# EAGLE design hydrogen_sensors_board_v3 (EAGLE 9.1.0)
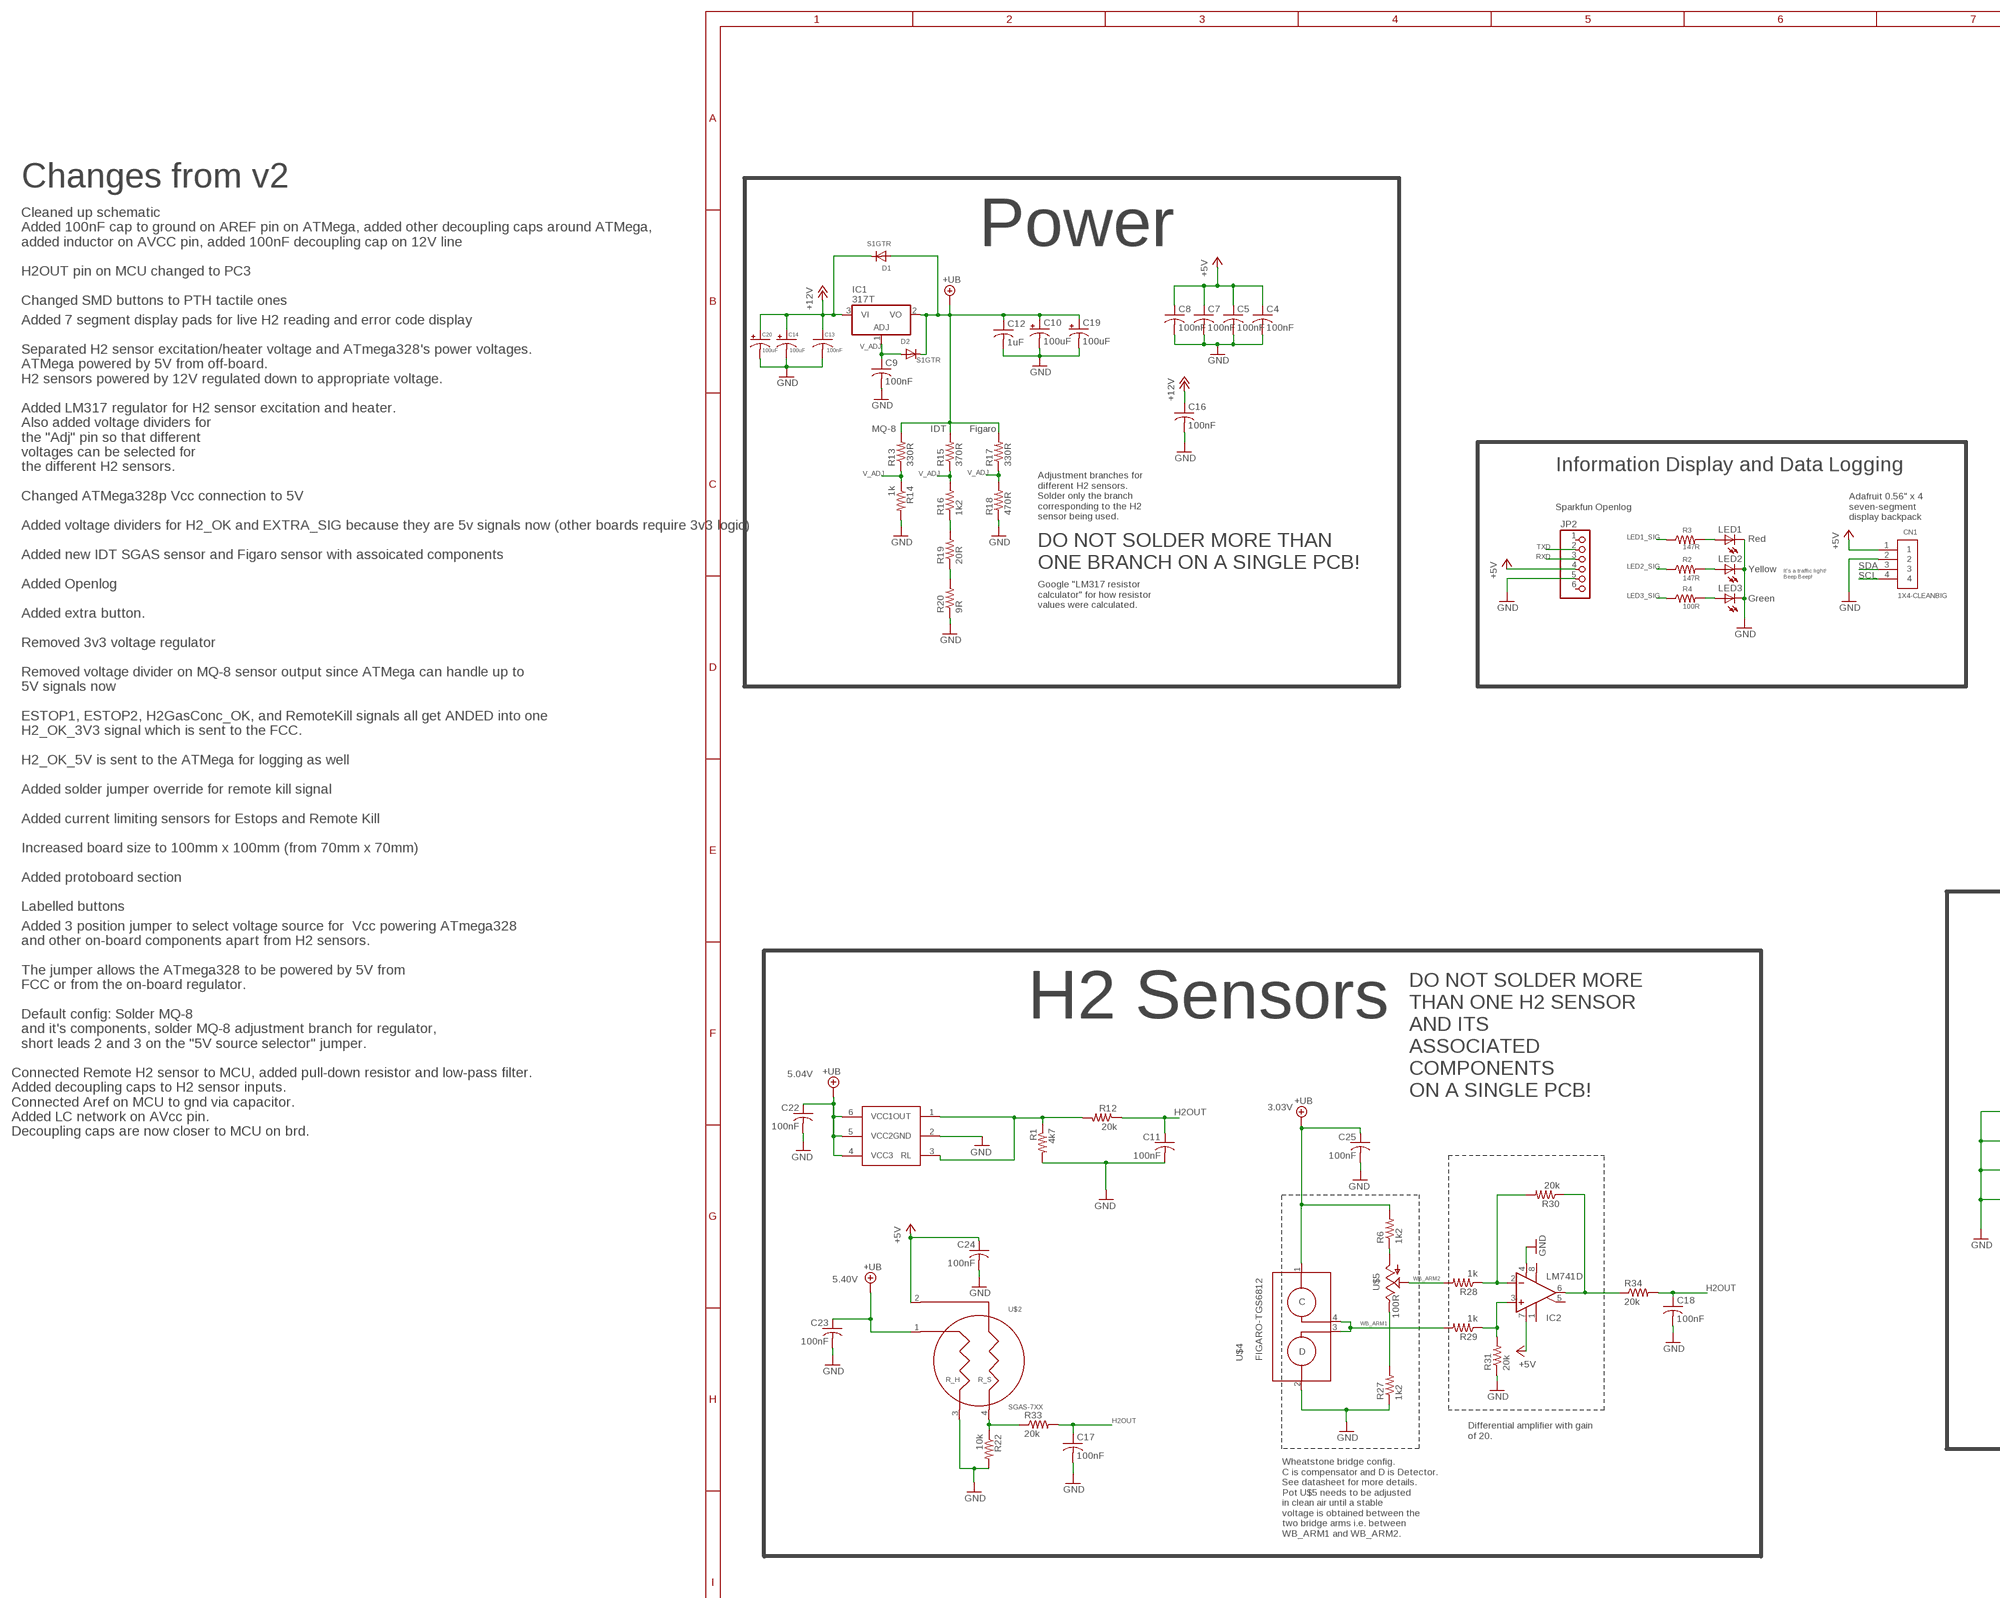
[diagram p0: schematic, sheet 1, part 1 of 2]
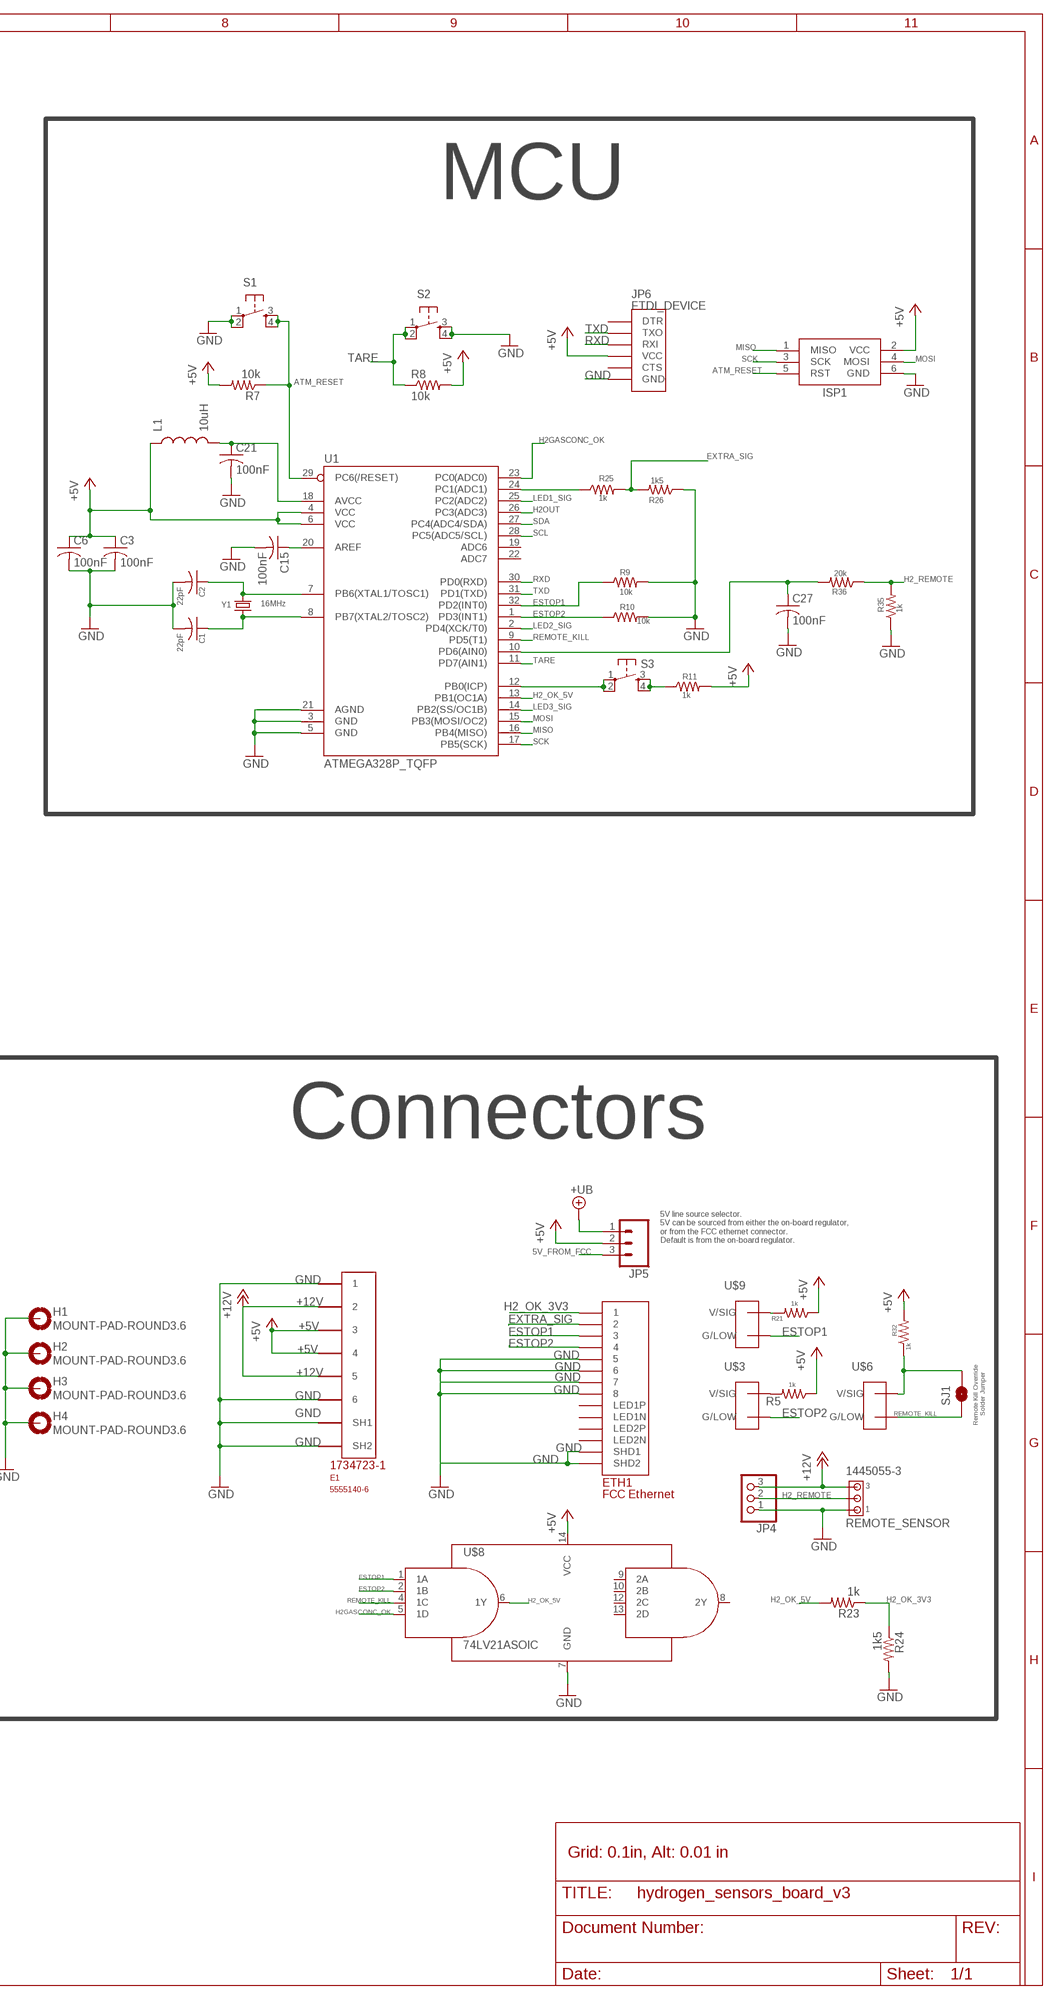
[diagram p1: schematic, sheet 1, part 2 of 2]

## Parts
C1  22pF  C-USC0603K  [C0603K]
C2  22pF  C-USC0603K  [C0603K]
C3  100nF  C-USC0603  [C0603]
C4  100nF  C-USC0603  [C0603]
C5  100nF  C-USC0603  [C0603]
C6  100nF  C-USC0603  [C0603]
C7  100nF  C-USC0603  [C0603]
C8  100nF  C-USC0603  [C0603]
C9  100nF  C-USC0603  [C0603]
C10  100uF  CPOL-USB/3528-21R  [B/3528-21R]
C11  100nF  C-USC0603  [C0603]
C12  1uF  C-USC0603  [C0603]
C13  100nF  C-USC0603  [C0603]
C14  100uF  CPOL-USB/3528-21R  [B/3528-21R]
C15  100nF  C-USC0603  [C0603]
C16  100nF  C-USC0603  [C0603]
C17  100nF  C-USC0603  [C0603]
C18  100nF  C-USC0603  [C0603]
C19  100uF  CAP_POLPTH1  [CPOL-RADIAL-100UF-25V]
C20  100uF  CAP_POLPTH1  [CPOL-RADIAL-100UF-25V]
C21  100nF  C-USC0603  [C0603]
C22  100nF  C-USC0603  [C0603]
C23  100nF  C-USC0603  [C0603]
C24  100nF  C-USC0603  [C0603]
C25  100nF  C-USC0603  [C0603]
C27  100nF  C-USC0603  [C0603]
CN1  1X4-CLEANBIG  [1X04-CLEANBIG]
D1  S1GTR  DIODESMA  [SMADIODE]
D2  S1GTR  DIODESMA  [SMADIODE]
E1  5555140-6  [1734723-1_RJ11]
ETH1  FCC Ethernet  ETHERNET  [A122645-ND]
H1  MOUNT-PAD-ROUND3.6  [3,6-PAD]
H2  MOUNT-PAD-ROUND3.6  [3,6-PAD]
H3  MOUNT-PAD-ROUND3.6  [3,6-PAD]
H4  MOUNT-PAD-ROUND3.6  [3,6-PAD]
IC1  317T  [TO220H]
IC2  LM741D  [SO08]
ISP1  AVRISP-BOX  [AVRISP-BOX]
JP2  PINHD-1X6LOCK  [1X06-BIGLOCK]
JP4  PINHD-1X3  [1X03]
JP5  M03PTH  [1X03]
JP6  FTDI_DEVICE  [FTDI_DEVICE_SIDE]
L1  10uH  INDUCTOR0603  [0603]
LED1  Red  LEDCHIPLED_0805  [CHIPLED_0805]
LED2  Yellow  LEDCHIPLED_0805  [CHIPLED_0805]
LED3  Green  LEDCHIPLED_0805  [CHIPLED_0805]
R1  4k7  RESISTOR0603-RES  [0603-RES]
R2  147R  RESISTOR0603-RES  [0603-RES]
R3  147R  RESISTOR0603-RES  [0603-RES]
R4  100R  RESISTOR0603-RES  [0603-RES]
R5  1k  RESISTOR0603-RES  [0603-RES]
R6  1k2  RESISTOR0603-RES  [0603-RES]
R7  10k  RESISTOR0603-RES  [0603-RES]
R8  10k  RESISTOR0603-RES  [0603-RES]
R9  10k  RESISTOR0603-RES  [0603-RES]
R10  10k  RESISTOR0603-RES  [0603-RES]
R11  1k  RESISTOR0603-RES  [0603-RES]
R12  20k  RESISTOR0603-RES  [0603-RES]
R13  330R  RESISTOR0603-RES  [0603-RES]
R14  1k  RESISTOR0603-RES  [0603-RES]
R15  370R  RESISTOR0603-RES  [0603-RES]
R16  1k2  RESISTOR0603-RES  [0603-RES]
R17  330R  RESISTOR0603-RES  [0603-RES]
R18  470R  RESISTOR0603-RES  [0603-RES]
R19  20R  RESISTOR0603-RES  [0603-RES]
R20  9R  RESISTOR0603-RES  [0603-RES]
R21  1k  RESISTOR0603-RES  [0603-RES]
R22  10k  RESISTOR0603-RES  [0603-RES]
R23  1k  RESISTOR0603-RES  [0603-RES]
R24  1k5  RESISTOR0603-RES  [0603-RES]
R25  1k  RESISTOR0603-RES  [0603-RES]
R26  1k5  RESISTOR0603-RES  [0603-RES]
R27  1k2  RESISTOR0603-RES  [0603-RES]
R28  1k  RESISTOR0603-RES  [0603-RES]
R29  1k  RESISTOR0603-RES  [0603-RES]
R30  20k  RESISTOR0603-RES  [0603-RES]
R31  20k  RESISTOR0603-RES  [0603-RES]
R32  1k  RESISTOR0603-RES  [0603-RES]
R33  20k  RESISTOR0603-RES  [0603-RES]
R34  20k  RESISTOR0603-RES  [0603-RES]
R35  1k  RESISTOR0603-RES  [0603-RES]
R36  20k  RESISTOR0603-RES  [0603-RES]
REMOTE_SENSOR  1445055-3  [1445055-3]
S1  TAC_SWITCHPTH  [TACTILE-PTH]
S2  TAC_SWITCHPTH  [TACTILE-PTH]
S3  TAC_SWITCHPTH  [TACTILE-PTH]
SJ1  SOLDERJUMPERNO  [SJ_2S-NO]
U1  ATMEGA328P_TQFP  [TQFP32-08]
U$1  MQ-8MQ-8  [MQ-8]
U$2  SGAS-7XX  [TO39]
U$3  TE770966  [2X1-MATE-N-LOCK]
U$4  FIGARO-TGS6812  [4PTH]
U$5  100R  POT100K_3362U  [3362U]
U$6  TE770966  [2X1-MATE-N-LOCK]
U$8  74LV21ASOIC  [SOIC-14]
U$9  TE770966  [2X1-MATE-N-LOCK]
Y1  16MHz  CRYSTALHC49US  [HC49US]

## Nets
5V_FROM_FCC: JP5.3
+5V: C3.1 C4.1 C5.1 C6.1 C7.1 C8.1 C24.1 CN1.1 E1.3 E1.4 IC2.7(V+) ISP1.2(VCC) JP2.4 JP5.2 JP6.P$4(VCC) L1.1 R5.1 R7.2 R8.2 R11.2 R21.1 R32.2 U1.4(VCC) U1.6(VCC) U$2.2 U$8.14(VCC)
+12V: C13.1 C14.+ C16.1 C20.1(+) D1.C E1.2 E1.5 IC1.3(VI) JP4.3 REMOTE_SENSOR.3
+UB: C10.+ C12.1 C19.1(+) C22.1 C23.1 C25.1 D1.A D2.C IC1.2(VO) JP5.1 R6.2 R13.2 R15.2 R17.2 U$1.4(VCC3) U$1.5(VCC2) U$1.6(VCC1) U$2.1 U$4.1
ATM_RESET: ISP1.5(RST) R7.1 S1.3 S1.4 U1.29(PC6(/RESET))
ESTOP1: ETH1.P$3 R9.1 U1.32(PD2(INT0)) U$8.1(1A) U$9.CIRCUIT2(G/LOW)
ESTOP2: ETH1.P$4 R10.1 U1.1(PD3(INT1)) U$3.CIRCUIT2(G/LOW) U$8.2(1B)
EXTRA_SIG: ETH1.P$2 R25.2 R26.2
GND: C1.2 C2.2 C3.2 C4.2 C5.2 C6.2 C7.2 C8.2 C9.2 C10.- C11.2 C12.2 C13.2 C14.- C15.2 C16.2 C17.2 C18.2 C19.2(-) C20.2(-) C21.2 C22.2 C23.2 C24.2 C25.2 C27.2 CN1.2 E1.1 E1.6 E1.SH1 E1.SH2 ETH1.P$5 ETH1.P$6 ETH1.P$7 ETH1.P$8 ETH1.P$13(SHD1) ETH1.P$14(SHD2) H1.B3,6(MOUNT) H2.B3,6(MOUNT) H3.B3,6(MOUNT) H4.B3,6(MOUNT) IC2.4(V-) ISP1.6(GND) JP2.5 JP4.1 JP6.P$6(GND) LED1.C LED2.C LED3.C R1.2 R9.2 R10.2 R14.2 R18.1 R20.1 R22.2 R24.2 R26.1 R27.1 R31.1 R35.1 REMOTE_SENSOR.1 S1.1 S1.2 S2.3 S2.4 U1.3(GND) U1.5(GND) U1.21(AGND) U$1.2(GND) U$2.3 U$4.2 U$8.7(GND)
H2_OK_3V3: ETH1.P$1 R23.1 R24.1
H2_OK_5V: R23.2 U1.13(PB1(OC1A)) U$8.6(1Y)
H2_REMOTE: JP4.2 R35.2 R36.1 REMOTE_SENSOR.2
H2GASCONC_OK: U1.23(PC0(ADC0)) U$8.5(1D)
H2OUT: C11.1 C17.1 C18.1 R12.1 R33.2 R34.2 U1.26(PC3(ADC3))
LED1_SIG: R3.1 U1.25(PC2(ADC2))
LED2_SIG: R2.1 U1.2(PD4(XCK/T0))
LED3_SIG: R4.1 U1.14(PB2(SS/OC1B))
MISO: ISP1.1(MISO) U1.16(PB4(MISO))
MOSI: ISP1.4(MOSI) U1.15(PB3(MOSI/OC2))
N$1: C2.1 U1.7(PB6(XTAL1/TOSC1)) Y1.2
N$2: R6.1 U$5.P$3(A)
N$3: C1.1 U1.8(PB7(XTAL2/TOSC2)) Y1.1
N$4: C15.1 U1.20(AREF)
N$5: R22.1 R33.1 U$2.4
N$6: C27.1 R36.2 U1.10(PD6(AIN0))
N$7: LED1.A R3.2
N$8: LED2.A R2.2
N$9: LED3.A R4.2
N$10: R27.2 U$5.P$1(E)
N$11: R21.2 U$9.CIRCUIT1(V/SIG)
N$12: R25.1 U1.24(PC1(ADC1))
N$13: IC2.2(-IN) R28.1 R30.2
N$14: R16.1 R19.2
N$15: S3.1 S3.2 U1.12(PB0(ICP))
N$16: R11.1 S3.3 S3.4
N$17: R19.1 R20.2
N$18: R1.1 R12.2 U$1.1(OUT) U$1.3(RL)
N$20: IC2.6(OUT) R30.1 R34.1
N$21: R5.2 U$3.CIRCUIT1(V/SIG)
N$22: IC2.3(+IN) R29.1 R31.2
N$24: R32.1 SJ1.2 U$6.CIRCUIT1(V/SIG)
N$62: C21.1 L1.2 U1.18(AVCC)
REMOTE_KILL: SJ1.1 U1.9(PD5(T1)) U$6.CIRCUIT2(G/LOW) U$8.4(1C)
RXD: JP2.3 JP6.P$3(RXI) U1.30(PD0(RXD))
SCK: ISP1.3(SCK) U1.17(PB5(SCK))
SCL: CN1.4 U1.28(PC5(ADC5/SCL))
SDA: CN1.3 U1.27(PC4(ADC4/SDA))
TARE: R8.1 S2.1 S2.2 U1.11(PD7(AIN1))
TXD: JP2.2 JP6.P$2(TXO) U1.31(PD1(TXD))
V_ADJ: C9.1 D2.A IC1.1(ADJ) R13.1 R14.1 R15.1 R16.2 R17.1 R18.2
WB_ARM1: R29.2 U$4.3 U$4.4
WB_ARM2: R28.2 U$5.P$2(S)
Unconnected: ETH1.P$9(LED1N) ETH1.P$10(LED1P) ETH1.P$11(LED2N) ETH1.P$12(LED2P) IC2.1(ON1) IC2.5(ON2) IC2.8(OPT) JP2.1 JP2.6 JP6.P$1(DTR) JP6.P$5(CTS) U1.19(ADC6) U1.22(ADC7) U$8.8(2Y) U$8.9(2A) U$8.10(2B) U$8.12(2C) U$8.13(2D)

## Notes on the sheet
- MCU
- Changes from v2
- Cleaned up schematic
  Added 100nF cap to ground on AREF pin on ATMega, added other decoupling caps around ATMega, 
  added inductor on AVCC pin, added 100nF decoupling cap on 12V line
- Power
- H2OUT pin on MCU changed to PC3
- Changed SMD buttons to PTH tactile ones
- Added 7 segment display pads for live H2 reading and error code display
- Separated H2 sensor excitation/heater voltage and ATmega328's power voltages.
  ATMega powered by 5V from off-board.
  H2 sensors powered by 12V regulated down to appropriate voltage.
- MQ-8 | IDT | Figaro
- Added LM317 regulator for H2 sensor excitation and heater.
  Also added voltage dividers for 
  the "Adj" pin so that different 
  voltages can be selected for
  the different H2 sensors.
- Information Display and Data Logging
- Changed ATMega328p Vcc connection to 5V
- Sparkfun Openlog
- Adafruit 0.56" x 4 
  seven-segment 
  display backpack
- Added voltage dividers for H2_OK and EXTRA_SIG because they are 5v signals now (other boards require 3v3 logic)
- Adjustment branches for 
  different H2 sensors. 
  Solder only the branch 
  corresponding to the H2 
  sensor being used.
- Added new IDT SGAS sensor and Figaro sensor with assoicated components
- DO NOT SOLDER MORE THAN
  ONE BRANCH ON A SINGLE PCB!
- It's a traffic light!
  Beep Beep!
- Added Openlog
- Google "LM317 resistor 
  calculator" for how resistor 
  values were calculated.
- Added extra button.
- Removed 3v3 voltage regulator
- Removed voltage divider on MQ-8 sensor output since ATMega can handle up to 
  5V signals now
  
  ESTOP1, ESTOP2, H2GasConc_OK, and RemoteKill signals all get ANDED into one
  H2_OK_3V3 signal which is sent to the FCC.
- H2_OK_5V is sent to the ATMega for logging as well
- Added solder jumper override for remote kill signal
  
  Added current limiting sensors for Estops and Remote Kill
- Increased board size to 100mm x 100mm (from 70mm x 70mm)
  
  Added protoboard section
  
  Labelled buttons
- Connectors
- H2 Sensors
- Added 3 position jumper to select voltage source for  Vcc powering ATmega328
  and other on-board components apart from H2 sensors.
  
  The jumper allows the ATmega328 to be powered by 5V from 
  FCC or from the on-board regulator.
  
  Default config: Solder MQ-8 
  and it's components, solder MQ-8 adjustment branch for regulator, 
  short leads 2 and 3 on the "5V source selector" jumper.
- 5V line source selector.
  5V can be sourced from either the on-board regulator, 
  or from the FCC ethernet connector.
  Default is from the on-board regulator.
- 5.04V
- DO NOT SOLDER MORE
  THAN ONE H2 SENSOR
  AND ITS 
  ASSOCIATED 
  COMPONENTS
  ON A SINGLE PCB!
- 3.03V
- Connected Remote H2 sensor to MCU, added pull-down resistor and low-pass filter.
  Added decoupling caps to H2 sensor inputs.
  Connected Aref on MCU to gnd via capacitor.
  Added LC network on AVcc pin.
  Decoupling caps are now closer to MCU on brd.
- Remote Kill Override 
  Solder Jumper
- 5.40V
- Differential amplifier with gain
  of 20.
- Wheatstone bridge config.
  C is compensator and D is Detector.
  See datasheet for more details.
  Pot U$5 needs to be adjusted
  in clean air until a stable
  voltage is obtained between the
  two bridge arms i.e. between
  WB_ARM1 and WB_ARM2.
- Grid: 0.1in, Alt: 0.01 in

## Library data of the parts
C1-C9 C11-C13 C15-C18 C21-C25 C27 = adafruit:C-US: CAPACITOR, American symbol
C10 C14 = adafruit:CPOL-US: POLARIZED CAPACITOR, American symbol
C19 C20 = SparkFun-Capacitors:CAP_POL: Capacitor Polarized These are standard SMD and PTH capacitors. Normally 10uF, 47uF, and 100uF in electrolytic and tantalum varieties. Always verify the external diameter of the through hole cap, it varies with capacity, voltage, and manufacturer. The EIA devices should be standard.
CN1 = adafruit:1X4: 4-pin connector
D1 D2 = adafruit:DIODE: Diode SMADIODE - SMA Surface Mount Package 20V 1A Schottky Diode Digikey: 641-1014-6-ND DO-1N4148 - Through Hole Small Current Diode SOD-123 20V 1 A (.5mV Vf) Schottky Diode - Digikey: MBRX120TPMSCT-ND SOD-323 10V 570mA (.38mV Vf, 3ns) Schottky Diode - Digikey: ZLLS410CT-ND SOD-523 30V 30mA Schottky Diode (RB751S-40TE61) - Digikey: RB751S-40TE61CT-ND SOT23-R/W - SOT23 Package (R = Solder Paste/Reflow Ovens, W = Hand-Soldering) BAT54Film 40V 300mA - Digikey: 497-7162-1-ND
E1 = 5555140-6 RJ11:5555140-6
ETH1 = ETHERNET:ETHERNET: Ethernet port with 2 leds. digikey number A122645-ND
H1-H4 = holes:MOUNT-PAD-ROUND: MOUNTING PAD, round
IC1 = linear:*317: Positive VOLTAGE REGULATOR
IC2 = linear:*741: OP AMP
ISP1 = adafruit:AVRISP: AVR ISP HEADER Standard 6 pin header for AVR programming
JP2 = adafruit:PINHD-1X6: PIN HEADER
JP4 = pinhead:PINHD-1X3: PIN HEADER
JP5 = SparkFun:M03: Header 3 Standard 3-pin 0.1" header. Use with straight break away headers (SKU : PRT-00116), right angle break away headers (PRT-00553), swiss pins (PRT-00743), machine pins (PRT-00117), and female headers (PRT-00115). Molex polarized connector foot print use with SKU : PRT-08232 with associated crimp pins and housings.
JP6 = SparkFun-Connectors:FTDI_DEVICE: Connector which mates to FTDI basic or FTDI cable.
L1 = SparkFun:INDUCTOR: Inductors Basic Inductor/Choke - 0603 and 1206. Footprints are not proven and vary greatly between part numbers.
LED1-LED3 = adafruit:LED: LED OSRAM: - CHIPLED LG R971, LG N971, LY N971, LG Q971, LY Q971, LO R971, LY R971 LH N974, LH R974 LS Q976, LO Q976, LY Q976 LO Q996 - Hyper CHIPLED LW Q18S LB Q993, LB Q99A, LB R99A - SideLED LS A670, LO A670, LY A670, LG A670, LP A670 LB A673, LV A673, LT A673, LW A673 LH A674 LY A675 LS A676, LA A676, LO A676, LY A676, LW A676 LS A679, LY A679, LG A679 - Hyper Micro SIDELED® LS Y876, LA Y876, LO Y876, LY Y876 LT Y87S - SmartLED LW L88C, LW L88S LB L89C, LB L89S, LG L890 LS L89K, LO L89K, LY L89K LS L896, LA L896, LO L896, LY L896 - TOPLED LS T670, LO T670, LY T670, LG T670, LP T670 LSG T670, LSP T670, LSY T670, LOP T670, LYG T670 LG T671, LOG T671, LSG T671 LB T673, LV T673, LT T673, LW T673 LH T674 LS T676, LA T676, LO T676, LY T676, LB T676, LH T676, LSB T676, LW T676 LB T67C, LV T67C, LT T67C, LS T67K, LO T67K, LY T67K, LW E67C LS E67B, LA E67B, LO E67B, LY E67B, LB E67C, LV E67C, LT E67C LW T67C LS T679, LY T679, LG T679 LS T770, LO T770, LY T770, LG T770, LP T770 LB T773, LV T773, LT T773, LW T773 LH T774 LS E675, LA E675, LY E675, LS T675 LS T776, LA T776, LO T776, LY T776, LB T776 LHGB T686 LT T68C, LB T68C - Hyper Mini TOPLED® LB M676 - Mini TOPLED Santana® LG M470 LS M47K, LO M47K, LY M47K Source: http://www.osram.convergy.de/
R1 R5 R6 R9-R12 R21-R24 R27-R36 = SparkFun-Passives:RESISTOR: Resistor Basic schematic elements and footprints for 0603, 1206, and PTH resistors.
R2-R4 R7 R8 R13-R20 R25 R26 = SparkFun-Resistors:RESISTOR: Resistor Basic schematic elements and footprints for 0603, 1206, and PTH resistors.
REMOTE_SENSOR = con-amp:1445055-3: Micro MATE-N-LOK Connectors grid 1.5 mm Source: ENG_CD_1445055_A.pdf
S1-S3 = SparkFun:TAC_SWITCH: Momentary Switch Button commonly used for reset or general input. Spark Fun Electronics SKU : COM-00097
SJ1 = SparkFun:SOLDERJUMPER: Solder Jumper Standard SMD solder jumper. Used to automate production. Two varients : Normally Open and Normally Closed are the same, but have different paste layers. NC will have a large amount of paste and should jumper during reflow.
U1 = SparkFun-DigitalIC:ATMEGA328P_TQFP; PROD_ID: IC-09069
U$1 = donny_library:MQ-8
U$2 = gas-sensors-adnan:SGAS-7XX: Device for IDT SGAS 7xx family of sensors (701/707/711). This device created for H2 sensor (701) but can be used for other sensors in this family as well. Package is T039 with 4 leads.
U$3 U$6 U$9 = Shell2013:TE770966
U$4 = gas-sensors-adnan:FIGARO-TGS6812: Device for Figaro TGS6812 sensor Connect in wheatstone bridge configuration - see datasheet. Element D is sensitive to combustble gases. Element C is a reference element and is not sensitive to combustible gases. Use a potentiometer to adjust resistance of parallel arm until it matches the resistance of the C and D combo.
U$5 = SparkFun:POT
U$8 = SparkFun-DigitalIC:74LV21A: Quad input two circuit AND gate SOIC-14 package SN74LV21
Y1 = SparkFun-FreqCtrl:CRYSTAL: Various standard crystals. Proven footprints.

## Board
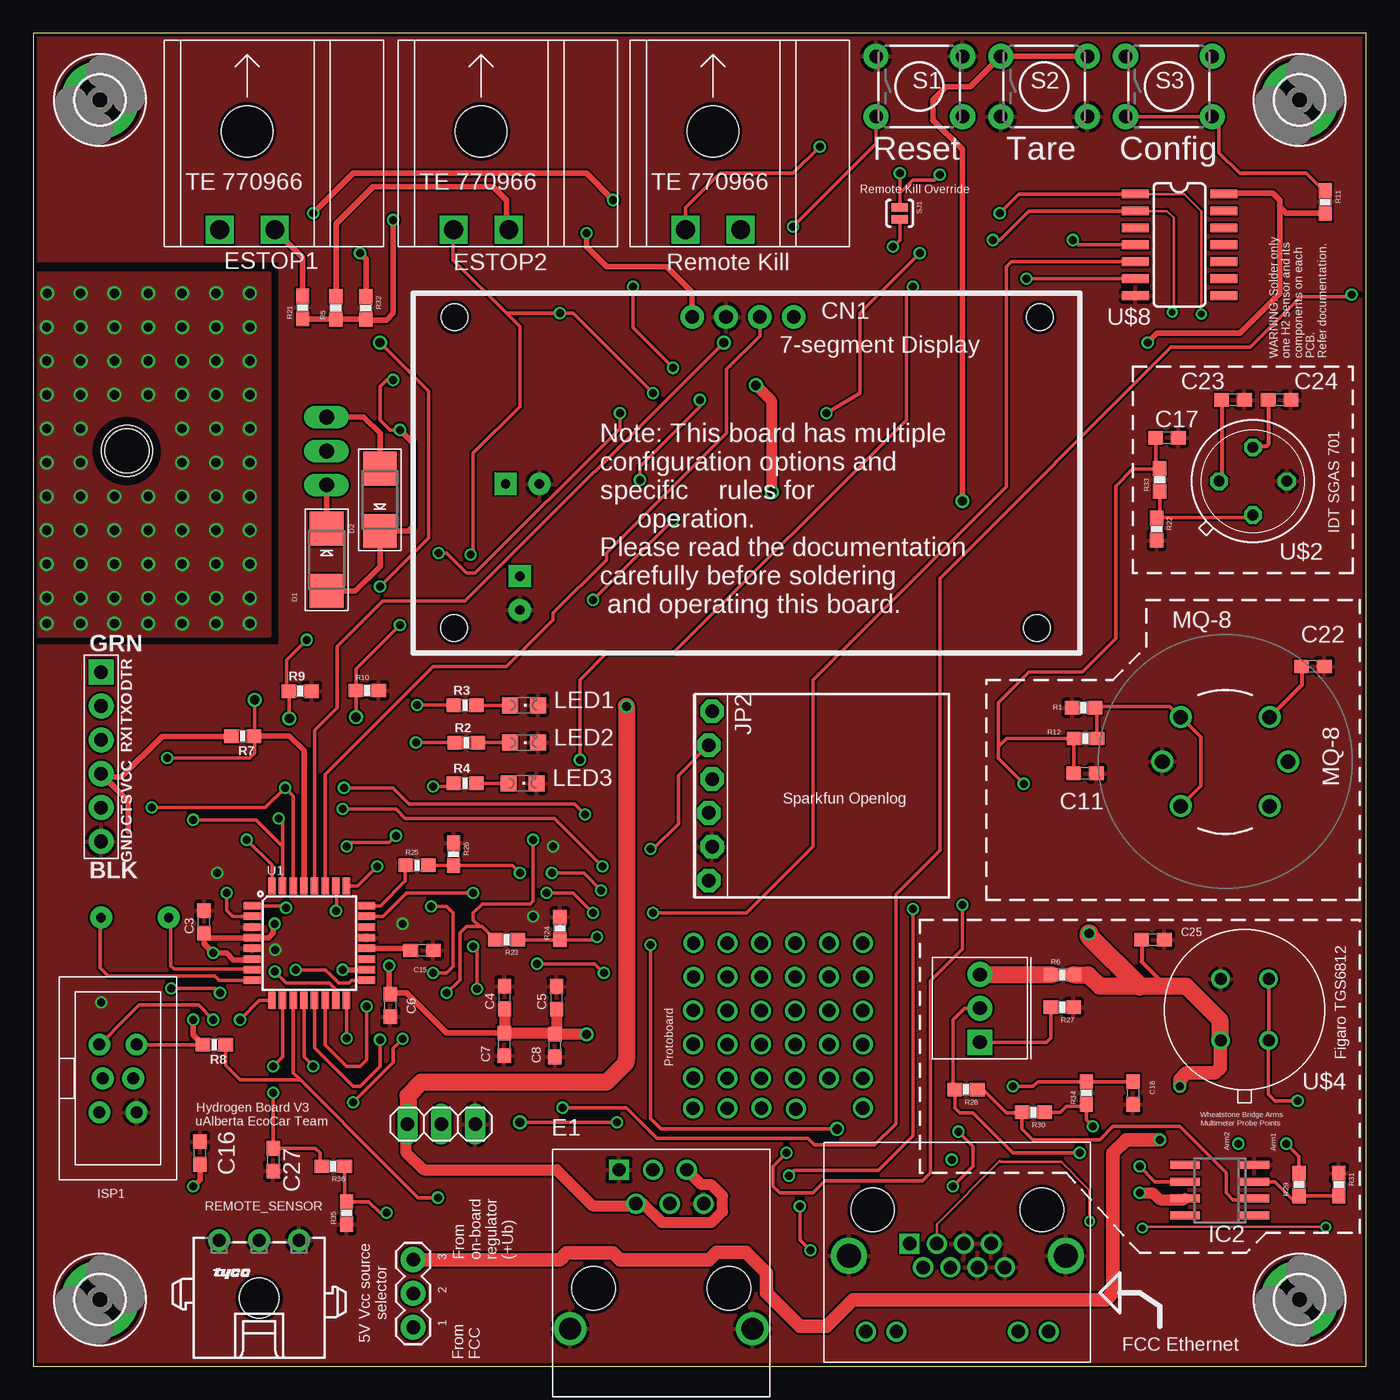
[diagram p2: board, top side]
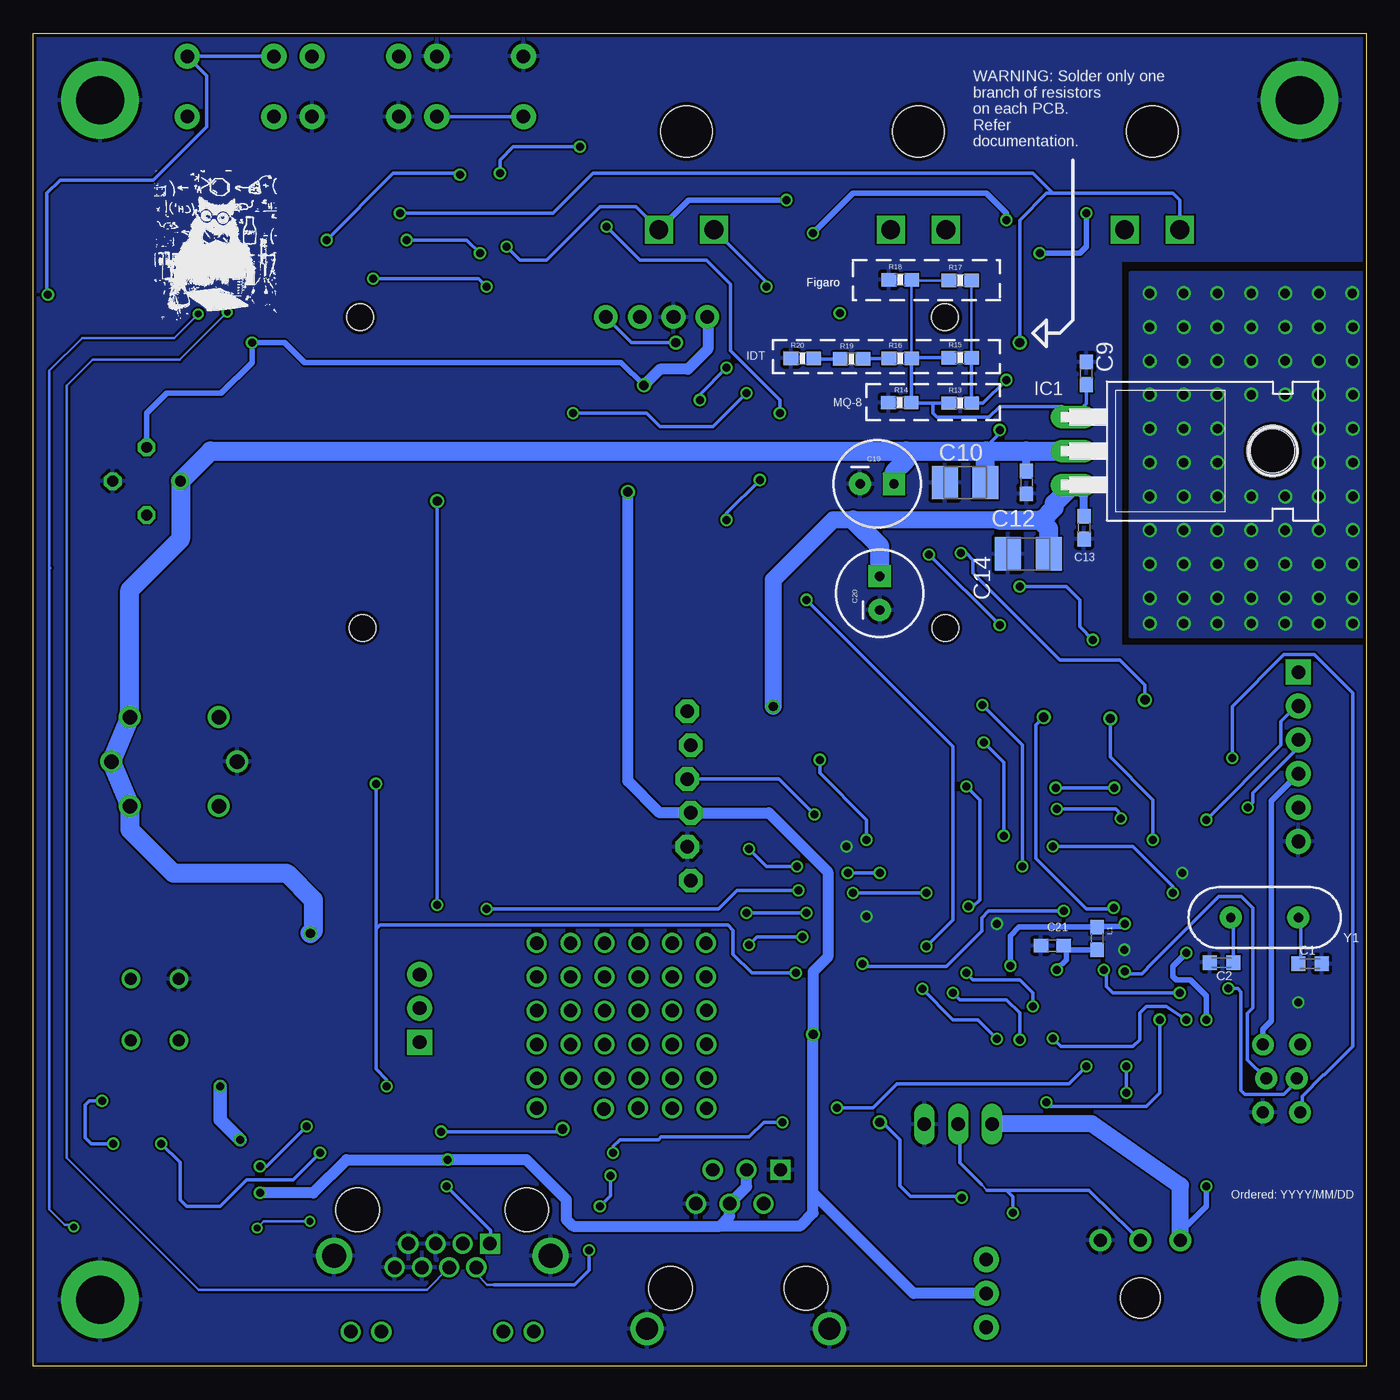
[diagram p3: board, bottom side, seen from below]

Size 100 x 100 mm. Coordinates in mm from the lower left corner, seen from the top.
Outline: 0,0 100,0 100,100 0,100 0,0
Copper layers (1*16): Top 0.035mm / dielectric 1.5mm / Bottom 0.035mm
Design rules "SeeedStudio_2layer_DRU_no_angle_20140221": minimum track width 6mil, minimum drill 12mil, track to track 6mil, track to pad 6mil, pad to pad 6mil, via to via 6mil, smd to smd 0mil, copper to edge 10mil, drill to drill 10mil, minimum pad ring 10mil, minimum via ring 6mil, stop-mask expansion 2mil, vias tented up to drill 100mil, thermal gap 10mil
Holes 2 mm at 31.6,78.7 75.5,78.7 75.3,55.39 31.58,55.39
Holes 3.84 mm at 7.01,68.67

### Footprints (pad centres in the part's own frame; a part is rotated, then mirrored left to right if it is on the bottom)
C0603K = smd 1.05 x 1.08: 1 -0.875,0; 2 0.875,0
C0603 = smd 1.1 x 1: 1 -0.85,0; 2 0.85,0
B/3528-21R = smd 1.95 x 2.5: + 1.525,0; - -1.525,0
CPOL-RADIAL-100UF-25V = drill 0.7 pad 1.651 square: 1 1.27,0 | drill 0.7 pad 1.651: 2 -1.27,0
1X04-CLEANBIG = drill 1.016 pad 1.778: 1 -3.81,0; 2 -1.27,0; 3 1.27,0; 4 3.81,0
SMADIODE = smd 2.54 x 2.54: A 2.349,0; C -2.349,0
1734723-1_RJ11 = drill 1 square: 1 -3.81,2.54 | drill 1: 2 -2.54,0; 3 -1.27,2.54; 4 0,0; 5 1.27,2.54; 6 2.54,0 | drill 1.65: SH1 -7.5,-9.4; SH2 6.22,-9.4 | hole 3.3: -5.72,-6.35; 4.44,-6.35
A122645-ND = drill 1 square: P$1 3.58,2.54 | drill 1: P$2 2.56,4.32; P$3 1.54,2.54; P$4 0.52,4.32; P$5 -0.5,2.54; P$6 -1.52,4.32; P$7 -2.54,2.54; P$8 -3.56,4.32; P$9 -6.86,9.14; P$10 -4.57,9.14; P$11 4.57,9.14; P$12 6.86,9.14 | drill 1.8: P$13 -8.13,3.43; P$14 8.13,3.43 | hole 3.25: -6.35,0; 6.35,0
3,6-PAD = drill 3.6 pad 5.842: B3,6 0,0
TO220H = drill 1.118 long: 1 -2.54,-10.16; 2 0,-10.16; 3 2.54,-10.16 | hole 3.302: 0,4.826
SO08 = smd 0.6 x 2.2: 1 -1.905,-2.6; 2 -0.635,-2.6; 3 0.635,-2.6; 4 1.905,-2.6; 5 1.905,2.6; 6 0.635,2.6; 7 -0.635,2.6; 8 -1.905,2.6
AVRISP-BOX = drill 0.9 pad 1.626: 1 -1.397,2.54; 2 1.397,2.54; 3 -1.143,0; 4 1.143,0; 5 -1.397,-2.54; 6 1.397,-2.54
1X06-BIGLOCK = drill 1.016 pad 1.778 octagon: 1 -6.35,0.127; 2 -3.81,-0.127; 3 -1.27,0.127; 4 1.27,-0.127; 5 3.81,0.127; 6 6.35,-0.127
1X03 = drill 1.016 long: 1 -2.54,0; 2 0,0; 3 2.54,0
1X03' = drill 1.016 pad 1.88: 1 0,0; 2 2.54,0; 3 5.08,0
FTDI_DEVICE_SIDE = drill 1.016 pad 1.88 square: P$1 -6.35,0 | drill 1.016 pad 1.88: P$2 -3.81,0; P$3 -1.27,0; P$4 1.27,0; P$5 3.81,0; P$6 6.35,0
0603 = smd 1.1 x 1: 1 -0.85,0; 2 0.85,0
CHIPLED_0805 = smd 1.2 x 1.2: A 0,-1.05; C 0,1.05
0603-RES = smd 1.1 x 1: 1 -0.85,0; 2 0.85,0
1445055-3 = drill 1 pad 1.676: 1 3,4.32; 2 0,4.32; 3 -3,4.32 | hole 3: 0,0
TACTILE-PTH = drill 1.016 pad 1.88: 1 -3.251,2.261; 2 3.251,2.261; 3 -3.251,-2.261; 4 3.251,-2.261
SJ_2S-NO = smd 0.635 x 1.27: 1 -0.45,0; 2 0.45,0
TQFP32-08 = smd 1.27 x 0.559: 1 -4.293,2.8; 2 -4.293,2; 3 -4.293,1.2; 4 -4.293,0.4; 5 -4.293,-0.4; 6 -4.293,-1.2; 7 -4.293,-2; 8 -4.293,-2.8; 17 4.293,-2.8; 18 4.293,-2; 19 4.293,-1.2; 20 4.293,-0.4; 21 4.293,0.4; 22 4.293,1.2; 23 4.293,2; 24 4.293,2.8 | smd 0.559 x 1.27: 9 -2.8,-4.293; 10 -2,-4.293; 11 -1.2,-4.293; 12 -0.4,-4.293; 13 0.4,-4.293; 14 1.2,-4.293; 15 2,-4.293; 16 2.8,-4.293; 25 2.8,4.293; 26 2,4.293; 27 1.2,4.293; 28 0.4,4.293; 29 -0.4,4.293; 30 -1.2,4.293; 31 -2,4.293; 32 -2.8,4.293
MQ-8 = drill 1.1: 1 -3.337,3.337; 2 -4.72,0; 3 -3.337,-3.337; 4 3.337,-3.337; 5 4.72,0; 6 3.337,3.337
TO39 = drill 0.813 octagon: 1 -2.54,0; 2 0,2.54; 3 2.54,0; 4 0,-2.54
2X1-MATE-N-LOCK = drill 1.4 square: CIRCUIT1 -2.07,14.23; CIRCUIT2 2.07,14.23 | hole 3.86: 0,6.86
4PTH = drill 0.9: 1 -1.8,-2.3; 2 -1.8,2.3; 3 1.8,2.3; 4 1.8,-2.3
3362U = drill 1.016 pad 1.88 square: P$1 0,2.54 | drill 1.016 pad 1.88: P$2 2.54,2.54; P$3 5.08,2.54
SOIC-14 = smd 0.66 x 2.032: 1 -4.445,-3.315; 2 -3.175,-3.315; 3 -1.905,-3.315; 4 -0.635,-3.315; 5 0.635,-3.315; 6 1.905,-3.315; 7 3.175,-3.315; 8 3.175,3.315; 9 1.905,3.315; 10 0.635,3.315; 11 -0.635,3.315; 12 -1.905,3.315; 13 -3.175,3.315; 14 -4.445,3.315
HC49US = drill 0.7 pad 1.651: 1 -2.54,0; 2 2.54,0

### Placement (x,y rotation side)
C1  4.21,30.19 0 bottom
C2  10.84,30.29 180 bottom
C3  12.81,33.33 90 top
C4  35.36,27.66 90 top
C5  39.26,27.64 90 top
C6  26.78,27.07 270 top
C7  35.33,24.14 270 top
C8  39.13,24.06 270 top
C9  21,74.5 90 bottom
C10  30.1,66.3 0 bottom
C11  78.9,44.48 0 top
C12  25.49,66.31 270 bottom
C13  21.17,62.91 270 bottom
C14  25.35,60.95 0 bottom
C15  29.15,31.2 0 top
C16  12.5,16 90 top
C17  85.05,69.65 0 top
C18  82.5,20.5 270 top
C19  36.7,66.2 0 bottom
C20  36.5,58 90 bottom
C21  23.55,31.55 180 bottom
C22  96,52.5 0 top
C23  90,72.5 0 top
C24  93.5,72.5 0 top
C25  84,32 0 top
C27  18,15.5 270 top
CN1  53.24,78.72 0 top
D1  22,60.5 270 top
D2  26,65 90 top
E1  47.75,12.19 0 top
ETH1  69.32,11.73 180 top
H1  5,95 0 top
H2  95,95 0 top
H3  95,5 0 top
H4  5,5 0 top
IC1  11.84,68.66 270 bottom
IC2  89.02,13.21 90 top
ISP1  6.35,21.59 0 top
JP2  50.8,42.78 270 top
JP4  30.61,18.16 180 top
JP5  [1X03']  28.5,8 270 top
JP6  5.08,45.72 270 top
L1  20.2,32.1 270 bottom
LED1  36.81,49.58 270 top
LED2  36.81,46.78 270 top
LED3  36.71,43.73 270 top
R1  78.79,49.4 180 top
R2  32.49,46.78 0 top
R3  32.39,49.58 0 top
R4  32.39,43.73 0 top
R5  22.7,79.4 90 top
R6  77.21,29.37 0 top
R7  15.7,47.27 180 top
R8  13.58,24.12 180 top
R9  20.02,50.65 0 top
R10  25.05,50.69 0 top
R11  96.94,87.34 270 top
R12  78.94,47.1 0 top
R13  30.46,72.25 0 bottom
R14  35,72.3 180 bottom
R15  30.46,75.66 0 bottom
R16  34.96,75.61 0 bottom
R17  30.46,81.46 0 bottom
R18  34.96,81.51 0 bottom
R19  38.61,75.56 0 bottom
R20  42.31,75.62 0 bottom
R21  20.21,79.43 90 top
R22  84.28,62.81 270 top
R23  35.5,32 180 top
R24  39.51,32.84 90 top
R25  28.79,37.58 0 top
R26  31.53,38.41 270 top
R27  77.19,26.93 180 top
R28  69.98,20.76 180 top
R29  94.96,13.62 90 top
R30  75.03,19.05 180 top
R31  97.95,13.63 270 top
R32  24.95,79.39 270 top
R33  84.5,66.5 90 top
R34  79,20.5 90 top
R35  23.5,11.5 90 top
R36  22.5,15 180 top
REMOTE_SENSOR  16.94,5.12 0 top
S1  66.47,96.02 0 top
S2  75.84,96.02 0 top
S3  85.2,96.02 0 top
SJ1  65,86.5 270 top
U1  20.7,31.75 0 top
U$1  89.42,45.36 0 top
U$2  91.5,66.4 0 top
U$3  33.6,99.5 180 top
U$4  90.88,26.75 0 top
U$5  73.56,24.31 90 top
U$6  51,99.5 180 top
U$8  86,83.5 270 top
U$9  16.05,99.5 180 top
Y1  7.62,33.66 180 bottom

### Tracks (layer width: path | path; a pad name or v marks a point on that pad's centre or on a via)
5V_FROM_FCC
  Bottom 0.813: 28.08,3 JP5.3
+5V  (via drill 0.6, 0.7)
  Top 0.254: 35.21,24.87 C7.1 35.36,25.02 | 39.26,25.04 C8.1 39.02,25.02 | R8.2 ISP1.2 | 14.82,47.24 R7.2 | 89.37,88 U$8.14
  Top 0.305: C24.1 92.65,69.15 92.5,69 91.56,69 U$2.2
  Top 0.406: 14.82,47.24 9.65,47.24 6.6,44.2 5.33,44.2 JP6.P$4 7.11,42.42 7.11,40.13 | CN1.1 49.4,78.75 49.4,80.6 47.5,82.5 43,82.5 41.5,84 v41.5,85 | 93.5,87 93.5,80.5 90.5,77.5 84.3,77.5 v83.6,76.8 | 93.5,87 93.5,87.5 93,88 89.37,88 | R11.2 94.01,86.49 93.5,87 | R21.1 20.24,78.55 R5.1 R32.2 24.99,78.5 26.5,78.5 27,79 v27,86 | R8.2 12,24.86 v12,26 | C7.1 31,25 28,28 26.86,28 C6.1 26.7,28 v26.7,30.05 | U1.6 16.36,30.5 15,30.5 14.5,31 v13.5,31 12.81,31.69 C3.1 | 12.83,32.5 C3.1 | C3.1 13.14,32.15 U1.4 17.65,32.15 18,32.5 18,33.1 v18.1,33.2
  Top 0.61: C8.1
  Top 0.813: C4.1 35.36,25.02 39.02,25.02 | C5.1 39.26,25.04 | v41.5,24.9 C8.1 | v55.4,65.6 55.4,72.4 v54.2,73.6 | v83,13 84,13 84.5,12.5 86.34,12.5 IC2.7
  Bottom 0.254: 54.1,73.7 v54.2,73.6
  Bottom 0.406: JP6.P$4 7.11,42.42 7.11,25.91 7.75,25.27 ISP1.2 | 49.4,78.69 CN1.1 | v54.2,73.6 55.9,75.3 79.65,75.3 81.15,76.8 v83.6,76.8 83.6,75.3 85.9,73 90,73 91.5,71.5 U$2.2 | v27,86 27,86.5 28.5,88 38.5,88 v41.5,85 | v26.7,30.05 26.7,32.3 26.05,32.95 L1.1 20.15,33 18.3,33 v18.1,33.2 | v12,26 12,27.8 13.2,29 14.25,29 14.5,29.25 14.5,30 v13.5,31
  Bottom 0.813: 41.5,13 41.5,11.5 42.5,10.5 48.5,10.5 | 41.5,13 v41.5,24.9 41.5,29.6 40.4,30.7 40.4,37.1 44.81,41.51 JP2.4 53.01,41.51 55.4,43.9 v55.4,65.6 | 49.4,78.69 49.4,76.3 50.9,74.8 53,74.8 v54.2,73.6 | 48.5,10.5 47.75,11.25 E1.4 46.48,13.46 E1.3 | 48.5,10.5 59.5,10.5 60,11 60,12.5 63,15.5 v68.9,15.5 76.5,15.5 79,13 v83,13 | JP5.2 33.96,5.46 41.5,13
+12V  (via drill 0.6, 0.7)
  Top 0.406: C16.1 12.5,14 v12,13.5 | D1.C IC1.3
  Top 0.813: 27.94,18.03 27.94,16.06 29.27,14.73 39.27,14.73 42,12 45.02,12 E1.2 45.75,12.19 47.17,10.78 50.88,10.78 51.71,11.61 51.71,12.78 50.88,13.61 50.15,13.61 E1.5
  Top 1.016: 27.94,18.03 JP4.3
  Top 1.27: v44.5,49.5 44.5,23 44.45,22.95 44.45,22.75 43,21.3 29.1,21.3 28.1,20.3 28.1,18.19 JP4.3
  Bottom 0.406: v12,13.5 12,12 13.4,10.6 13.89,10.6 13.94,10.55
  Bottom 0.61: C13.1 21.17,65.3 IC1.3
  Bottom 1.27: 27.6,63.5 38.5,63.5 40,63.5 44.5,59 v44.5,49.5 | REMOTE_SENSOR.3 13.94,10.55 13.94,13.54 20.6,18.2 28.03,18.2 JP4.3
  Bottom 1.422: 27.6,63.5 24.5,63.5 | 24.5,63.5 24.3,63.5 23.4,64.4 23.4,64.72 IC1.3 | C14.+ 23.82,62.83 24.5,63.5 | C20.1 36.5,61.5 38.5,63.5
+UB  (via drill 0.6, 0.7)
  Top 0.254: v27,74 26.5,74 26,73.5 26,71 26.75,70.25 v27.5,70.25
  Top 0.305: C23.1 89.15,66.59 U$2.1 | C22.1 95.15,51.09 U$1.6 | C25.1 83.15,30.35 85,28.5
  Top 0.406: v27.5,70.25 28.5,69.25 28.5,63 28.15,62.65 D2.C 26,60 24.15,58.15 D1.A
  Top 0.813: 89.05,24.42 U$4.1
  Top 1.016: 89.05,24.42 89.05,22.4 88.65,22 86.5,22 86,21.5 v86,21 | v84.5,17 82,17 81,16 81,5.5 80.5,5 61.5,5 59.5,3 57.5,3 55,5.5 55,7 53.45,8.55 51.25,8.55 50.7,8 44,8 43.5,8.5 40,8.5 39.5,8 JP5.1
  Top 1.27: U$4.1 89,24.53 89,26 86.5,28.5 85,28.5 83,28.5 80,28.5 79.13,29.37 R6.2
  Top 1.422: v79.2,32.47 79.2,32.3 83,28.5
  Bottom 0.203: 21.84,68.5 IC1.2 | R17.2 R15.2
  Bottom 0.254: R15.2 R13.2 | 29.21,72.65 R13.2 | R13.2 28.75,72.25 v27,74 | v27.5,70.25 27.5,70 28.5,69 28.5,68.66
  Bottom 0.61: C12.1 25.5,68.66
  Bottom 1.016: v84.5,17 86,18.5 v86,21
  Bottom 1.422: IC1.2 25.5,68.66 28.5,68.66 | 34.5,68.66 86.7,68.66 U$2.1 88.96,62.04 92.76,58.24 U$1.6 U$1.5 U$1.4 92.76,40.26 89.5,37 81,37 79,35 79,32.66 v79.2,32.47 79.23,32.5 | 34.5,68.66 28.5,68.66 | C10.+ 28.57,68.58 28.5,68.66 | C19.1 35.43,67.07 34.5,68 34.5,68.66
ATM_RESET  (via drill 0.6, 0.7)
  Top 0.203: 20.32,36.06 U1.29
  Top 0.254: 16.58,47.3 R7.1 | v10.06,45.62 16.22,45.62 16.6,46 16.6,47.23 R7.1 | v16.6,50 16.6,47.32 R7.1 | v30.4,61 31,61 32.5,59.5 33.15,59.5 44,70.35 v44,71.5 | v57,85.5 63.2,91.7 63.2,93.73 S1.3
  Top 0.406: U1.29 20.3,46.2 19.2,47.3 16.58,47.3
  Bottom 0.254: v10.06,45.62 10.06,49.51 6.17,53.39 3.89,53.39 1,50.51 1,24 3.16,21.84 3.2,21.84 4.8,20.24 4.8,19.1 ISP1.5 | v57,85.5 54.5,83 49.5,83 47.7,81.2 47.7,76.2 44,72.5 v44,71.5 | v16.6,50 16.6,51.1 18.5,53 23,53 29.5,59.5 29.5,60.5 30,61 v30.4,61 | S1.4 S1.3
ESTOP1  (via drill 0.51, 0.6, 0.7)
  Top 0.203: U$8.1 86.35,87.94 87.63,86.67 87.63,79.02 v87.63,78.94 | v96.98,10.44 83.29,10.44 v83.21,10.36 | v79.25,10.87 79.25,13.18 77.11,15.32 72.59,15.32 72.52,15.39 67.78,10.65 ETH1.P$3
  Top 0.254: U1.32 17.9,37.6 v16,39.5 | v19.2,48.6 19.2,50.62 R9.1 | 19.2,50.68 R9.1 | U$8.1 73.94,87.94 v72.5,86.5 | v26,76.8 29.65,73.15 29.65,62.15 v26,58.5 | v20.5,54.5 19,53 19,50.82 R9.1
  Bottom 0.203: v87.63,78.94 89.43,77.14 95.4,77.14 | 95.4,77.14 95.61,77.14 | 95.4,77.14 96.34,77.14 98.81,74.68 98.81,59.97 | 98.81,59.97 98.73,59.89 | 98.81,59.97 98.81,11.79 97.64,10.62 97.16,10.62 v96.98,10.44 | v83.21,10.36 82.7,10.87 v79.25,10.87
  Bottom 0.254: v16,39.5 16,42.5 19.2,45.7 v19.2,48.6 | v26,76.8 26,86 24,88 23.5,88 | 23.5,88 14.5,88 14,87.5 14,85.29 U$9.CIRCUIT2 | v72.5,86.5 61,86.5 58,89.5 25,89.5 23.5,88 | v26,58.5 22.5,58.5 21.5,57.5 21.5,55.5 v20.5,54.5
ESTOP2  (via drill 0.51, 0.6, 0.7)
  Top 0.203: U$8.2 85.05,86.67 85.57,86.16 85.57,79.2 v85.45,79.07
  Top 0.254: v24.2,48.7 R10.1 24.2,52.3 v27.5,55.6 | 35.5,79 36.5,78 36.5,72 33,68.5 33,61.1 v32.8,60.9 | 35.5,79 31.5,83 31.5,85.24 U$3.CIRCUIT2 | U$8.2 74.67,86.67 72.5,84.5 v72,84.5 | 35.5,79 v39.5,79 40.5,79 v46.5,73 | v66.5,83.5 62,79 62,73 v59.5,71.5 | U1.1 18.8,34.55 v18.95,34.4
  Bottom 0.203: v85.45,79.07 89,75.51 95.53,75.51 97.48,73.56 97.48,15.62 87.61,5.74 70.47,5.74 ETH1.P$4
  Bottom 0.254: v24.2,48.7 24.8,48.1 24.8,38.1 21,34.3 19.05,34.3 v18.95,34.4 | v27.5,55.6 v32.8,60.9 | v66.5,83.5 67.5,84.5 v72,84.5 | v46.5,73 49,70.5 53,70.5 54,71.5 v59.5,71.5
EXTRA_SIG  (via drill 0.6)
  Top 0.254: v66,34.3 66,17.3 63.4,14.7 57.1,14.7 v56.7,14.3 | R25.2 31.51,37.58 R26.2 35.94,37.56 v36.5,37 | v38.9,37 41.3,37 v42.6,35.7 | v57.5,12 57.5,9.5 v58.3,8.7
  Bottom 0.203: 65.45,6.1 65.94,6.1 66.76,6.92 ETH1.P$2
  Bottom 0.254: 65.45,6.1 59.4,6.1 58.3,7.2 v58.3,8.7 | v42.6,35.7 47.2,35.7 48.6,34.3 v66,34.3 | v36.5,37 v38.9,37 | v56.7,14.3 56.7,12.8 v57.5,12
GND  (via drill 0.6, 0.6 pad 0.75)
  other vias: 5.08,27.3 13.78,37.02 39,39 27.7,33.2 37.5,33.75 18.15,31.25
  pour Bottom: 0,100 0,83 18.5,83 18.5,54 0,54 0,0 100,0 100,100
  pour Top: 0,100 0,83 18.5,83 18.5,54 0,54 0,0 100,0 100,100
H2_OK_3V3  (via drill 0.6, 0.7)
  Top 0.254: v46.3,31.6 46.3,18.6 47.1,17.8 v60.3,17.8 | R23.1 R24.1 42.09,31.99 v42.3,32.2 | v69,13.5 70.5,15 70.5,16.5 v69.4,17.6
  Bottom 0.254: v42.3,32.2 45.7,32.2 v46.3,31.6 | ETH1.P$1 65.7,9.23 65.7,10.2 v69,13.5 | v69.4,17.6 60.5,17.6 v60.3,17.8
H2_OK_5V  (via drill 0.6)
  Top 0.254: v37.5,39.5 37.5,34.9 37.3,34.7 33.7,34.7 33,34 33,33.5 33.5,33 | v66,81 65.5,80.5 65.5,71 48,53.5 43,53.5 41,51.5 v41,45.5 | U$8.6 v74.5,81.59 v74.5,81.6 | U1.13 21.1,23.9 24,21 24.5,21 26,22.5 v26,24.5 | v31,28 32,29 32,32.5 32.5,33 33.5,33 | R23.2 33.65,33 33.5,33
  Bottom 0.254: v74.5,81.6 66.6,81.6 v66,81 | v41,45.5 41,44.5 37.5,41 v37.5,39.5 | v31,28 30.5,27.5 27,27.5 26,26.5 v26,24.5
H2_REMOTE  (via drill 0.6)
  Top 0.254: R36.1 23.35,12.5 R35.2 25.15,12.35 26,11.5 v26.5,11.5
  Bottom 0.203: 28.44,13.2 28.87,13.63
  Bottom 0.254: 28.87,13.63 30.48,15.24 30.48,18.03 JP4.2 | REMOTE_SENSOR.2 18.94,11.34 20.8,13.2 27,13.2 | 27,13.2 28.44,13.2 | v26.5,11.5 26.5,12.7 27,13.2
H2GASCONC_OK  (via drill 0.6)
  Top 0.254: U$8.5 73.36,82.86 73,82.5 73,66 58.5,51.5 58.5,39 53.5,34 v46.5,34 | v38.5,35.5 40.5,35.5 v42,34 | U1.23 26.25,33.75 28,35.5 v33,35.5
  Bottom 0.254: v33,35.5 v38.5,35.5 | v42,34 v46.5,34
H2OUT  (via drill 0.6)
  Top 0.254: 72.4,46.5 72.4,45.6 v74.3,43.7 | v37.8,30.2 42.1,30.2 v42.8,29.5 | U1.26 22.75,35.99 22.75,34.2 v22.7,34.15 | 72.4,46.5 73,47.1 R12.1 78.05,47.1 C11.1 | 72.4,46.5 72.4,49.8 74.7,52.1 78.7,52.1 81.2,54.6 81.2,66.05 82.45,67.3 84.45,67.3 R33.2 84.2,67.65 C17.1 | v73.5,21 75,21 75.35,21.35 R34.2 C18.1
  Bottom 0.254: 74.3,32.8 v74.3,43.7 | 74.3,32.8 74,33.1 47.9,33.1 47.5,32.7 47.5,30.9 46.1,29.5 v42.8,29.5 | 74.3,32.8 74.3,22.3 73.5,21.5 v73.5,21 | v37.8,30.2 37.6,30 31.5,30 28.85,32.65 28.85,33.65 28.35,34.15 v22.7,34.15
HEATSINK  (via drill 0.7)
  other vias: 3.54,80.5 6.08,80.5 8.62,80.5 11.16,80.5 13.7,80.5 16.24,80.5 1,77.96 3.54,77.96 6.08,77.96 8.62,77.96 11.16,77.96 13.7,77.96 16.24,77.96 1,75.42 3.54,75.42 6.08,75.42 8.62,75.42 11.16,75.42 13.7,75.42 16.24,75.42 1,72.88 3.54,72.88 6.08,72.88 8.62,72.88 11.16,72.88 13.7,72.88 16.24,72.88 1,70.34 3.54,70.34 11.16,70.34 13.7,70.34 16.24,70.34 1,67.8 3.54,67.8 11.16,67.8 13.7,67.8 16.24,67.8 1,65.26 3.54,65.26 6.08,65.26 8.62,65.26 11.16,65.26 13.7,65.26 16.24,65.26 1,62.72 3.54,62.72 6.08,62.72 8.62,62.72 11.16,62.72 13.7,62.72 16.24,62.72 1,60.18 3.54,60.18 6.08,60.18 8.62,60.18 11.16,60.18 13.7,60.18 16.24,60.18 1,57.64 3.54,57.64 6.08,57.64 8.62,57.64 11.16,57.64 13.7,57.64 16.24,57.64 1,55.72 3.54,55.72 6.08,55.72 8.62,55.72 11.16,55.72 13.7,55.72 16.24,55.72 1.04,80.5
  pour Bottom: 0,82 17.7,82 17.7,54.8 0,54.8
  pour Top: 0,82 17.7,82 17.7,54.8 0,54.8
LED1_SIG  (via drill 0.6)
  Top 0.254: U1.25 24.34,36.04 v25.8,37.5 | v28.8,49.6 31.52,49.6 R3.1
  Bottom 0.254: v25.8,37.5 25.8,46.6 v28.8,49.6
LED2_SIG  (via drill 0.6)
  Top 0.254: v27.2,39.8 26.7,39.3 23.8,39.3 v23.5,39 | v28.7,46.8 31.61,46.8 R2.1 | v14.5,35.5 14.5,34.2 14.95,33.75 U1.2
  Bottom 0.254: v27.2,39.8 27.2,45.3 v28.7,46.8 | v23.5,39 17.5,39 14.5,36 v14.5,35.5
LED3_SIG  (via drill 0.6)
  Top 0.254: U1.14 21.9,24.1 23.5,22.5 24.5,22.5 25,23 v25,27 | v30,43.5 31.3,43.5 R4.1 | v30,29.5 31,29.5 31.5,30 31.5,34 31,34.5 v29.85,34.5
  Bottom 0.254: v30,29.5 29.5,29 26,29 25,28 v25,27 | v30,43.5 29,42.5 29,35 29.5,34.5 v29.85,34.5
MISO  (via drill 0.6)
  Top 0.254: ISP1.1 5.08,24.23 6.91,26.06 7.95,27.1 12.4,27.1 v13.5,26 | v23.5,24.6 U1.16
  Bottom 0.254: v23.5,24.6 22.9,24 17.5,24 17,24.5 17,26.5 16.5,27 15,27 v13.5,26
MOSI  (via drill 0.6)
  Top 0.254: 22.63,27.56 U1.15 22.65,27.51 22.65,28.3 22.2,28.75 18.98,28.75 v18.12,29.6
  Bottom 0.254: ISP1.4 7.54,21.61 8.91,22.99 8.91,26.48 8.5,26.9 8.5,34.38 9.37,35.25 11.06,35.25 16,30.3 16.85,29.45 17.97,29.45 v18.12,29.6
N$1
  Top 0.254: Y1.2 10.3,33.52 10.3,30.05 10.55,29.8 16.36,29.8 U1.7
  Bottom 0.254: 10.29,33.53 Y1.2 9.97,33.46 C2.1
N$2
  Top 1.27: U$5.P$3 76.34,29.39 R6.1
N$3
  Top 0.203: U1.8
  Top 0.254: Y1.1 5,33.58 5,29.9 5.6,29.3 13.6,29.3 13.94,28.96 U1.8
  Bottom 0.254: Y1.1 4.92,33.49 4.92,30.36 C1.1
N$4
  Top 0.406: 24.94,31.4 U1.20 27.65,31.35 C15.1
N$5
  Top 0.254: R33.1 84.5,63.88 R22.1 91.3,63.66 U$2.4
N$6  (via drill 0.6)
  Top 0.254: U1.10 18.7,23.2 v18,22.5 | v18,20.5 C27.1 21.15,16.35 21.5,16 21.5,15.15 R36.2
  Bottom 0.254: v18,22.5 v18,20.5
N$7
  Top 0.254: R3.2 LED1.A
N$8
  Top 0.254: R2.2 LED2.A
N$9
  Top 0.254: R4.2 LED3.A
N$10
  Top 0.254: U$5.P$1 76.01,24.31 76.35,24.65 76.35,26.42 R27.2
N$11
  Top 0.406: R21.2 20.21,83.18 U$9.CIRCUIT1
N$12
  Top 0.254: U1.24 26.05,34.55 27.9,36.4 27.9,37.54 R25.1
N$13
  Top 0.254: R28.1 71.24,20.76 73,19 74.12,19 R30.2 74.18,17.82 75,17 80,17 81,18 86,18 89.5,14.5 89.5,13 90,12.5 91.54,12.5 IC2.2
N$14
  Bottom 0.254: R16.1 37.71,75.61 R19.2
N$15  (via drill 0.6)
  Top 0.254: U1.12 20.3,23.2 v21,22.5 | v39.7,19.4 44.5,19.4 46.8,17.1 58.1,17.1 58.6,16.6 63.1,16.6 64.7,18.2 64.7,35.4 68,38.7 68,59.1 85.35,76.45 91.3,76.45 95.1,80.25 98.75,80.25 v98.9,80.4
  Bottom 0.254: v39.7,19.4 37,19.4 35.2,21.2 22.3,21.2 v21,22.5 | S3.1 S3.2 87,96.83 87,93 91,89 98,89 99,88 99,80.5 v98.9,80.4
N$16
  Top 0.254: R11.1 96.81,88.19 95.5,89.5 90.5,89.5 88.95,91.05 88.95,93.25 S3.4 S3.3
N$17
  Bottom 0.254: R19.1 41.41,75.56 R20.2
N$18
  Top 0.254: U$1.1 | U$1.1 86.1,48.7 87.6,47.2 87.6,43.54 U$1.3 | U$1.1 85.28,49.5 79.64,49.5 R1.1 79.79,49.4 R12.2
N$20  (via drill 0.6)
  Top 0.254: v79.5,18 79,18.5 R34.1 78.85,19.5 77.5,19.5 77.05,19.05 R30.1 | v83,15 84.15,13.85 IC2.6
  Bottom 0.254: v79.5,18 82.5,15 v83,15
N$21
  Top 0.406: R5.2 22.7,85.7 25.5,88.5 34.5,88.5 35.5,87.5 35.5,85.44 U$3.CIRCUIT1
N$22
  Top 0.254: R31.2 R29.1 94.68,12.5 94.5,12.5 93.15,13.85 IC2.3
N$23  (via drill 1)
  other vias: 49.5,21.62
N$24  (via drill 0.6)
  Top 0.254: SJ1.2 65,84.5 v64.5,84
  Top 0.406: R32.1 24.95,83.05 v24.5,83.5 | v21,86.5 24,89.5 41.5,89.5 v43.5,87.5
  Bottom 0.254: v64.5,84 63.5,83 61.5,83 57.5,87 54.8,87 U$6.CIRCUIT1
  Bottom 0.406: v43.5,87.5 50.84,87.5 U$6.CIRCUIT1 | v21,86.5 21,84 21.5,83.5 v24.5,83.5
N$25  (via drill 1)
  other vias: 49.53,29.21
N$26  (via drill 1)
  other vias: 49.53,31.75
N$27  (via drill 1)
  other vias: 52.07,21.59
N$28  (via drill 1)
  other vias: 54.61,31.75
N$29  (via drill 1)
  other vias: 57.15,31.75
N$30  (via drill 1)
  other vias: 59.69,31.75
N$31  (via drill 1)
  other vias: 62.23,31.75
N$32  (via drill 1)
  other vias: 62.23,21.59
N$33  (via drill 1)
  other vias: 62.23,29.21
N$34  (via drill 1)
  other vias: 59.69,29.21
N$35  (via drill 1)
  other vias: 54.61,29.21
N$36  (via drill 1)
  other vias: 52.07,31.75
N$37  (via drill 1)
  other vias: 52.07,29.21
N$38  (via drill 1)
  other vias: 52.07,26.67
N$39  (via drill 1)
  other vias: 49.5,26.7
N$40  (via drill 1)
  other vias: 49.5,24.16
N$41  (via drill 1)
  other vias: 52.07,24.13
N$42  (via drill 1)
  other vias: 52.07,19.35
N$43  (via drill 1)
  other vias: 49.49,19.35
N$44  (via drill 1)
  other vias: 54.63,19.37
N$45  (via drill 1)
  other vias: 54.61,21.59
N$46  (via drill 1)
  other vias: 54.61,24.13
N$47  (via drill 1)
  other vias: 54.61,26.67
N$48  (via drill 1)
  other vias: 57.15,29.21
N$49  (via drill 1)
  other vias: 57.15,26.67
N$50  (via drill 1)
  other vias: 57.15,24.13
N$52  (via drill 1)
  other vias: 57.2,19.3
N$55  (via drill 1)
  other vias: 59.69,21.59
N$56  (via drill 1)
  other vias: 59.69,24.13
N$58  (via drill 1)
  other vias: 59.69,26.67
N$59  (via drill 1)
  other vias: 62.23,26.67
N$60  (via drill 1)
  other vias: 62.23,24.13
N$61  (via drill 1)
  other vias: 62.23,19.37
N$62  (via drill 0.6)
  Top 0.406: U1.18 v23.2,29.75
  Bottom 0.406: L1.2 22.4,31.25 C21.1 22.5,31.35 22.5,30.5 23.2,29.8 v23.2,29.75
P2  (via drill 1)
  other vias: 57.15,21.59
REMOTE_KILL  (via drill 0.6)
  Top 0.254: U1.9 16.96,27.46 v15.5,26 | v24,19.8 27,22.8 27,23.85 v27.7,24.55 | v42,57.5 v48,63.5 | v45.5,66.5 45.5,67.5 50,72 v50,72.5 | U$6.CIRCUIT2 48.93,86.93 51.5,89.5 57,89.5 v59,91.5 | v65,89.5 65,88 | 65,88 SJ1.1 | U$8.4 78.36,84.14 v78,84.5 | 65,88 66,89 67.6,89 v68,89.4 | v45,81 45,77.9 v48,74.9 | v33.3,28.3 33.3,31.2 v33,31.5
  Bottom 0.254: v15.5,26 15.5,20.5 16.5,19.5 23.7,19.5 v24,19.8 | v33.3,28.3 31,26 29.15,26 v27.7,24.55 | v42,57.5 31,46.5 31,33.5 v33,31.5 | v48,63.5 48,64 v45.5,66.5 | v45,81 45,81.34 U$6.CIRCUIT2 | v59,91.5 64,91.5 65,90.5 v65,89.5 | v78,84.5 73,89.5 68.1,89.5 v68,89.4 | v50,72.5 50,72.9 v48,74.9
RXD  (via drill 0.6)
  Top 0.254: v8.89,41.91 17.41,41.91 v18.9,43.4 19.5,42.8 U1.30 | v23.3,43.4 27,43.4 28.2,42.2 40.6,42.2 v41.4,41.4
  Bottom 0.254: JP2.3 44.05,44.05 v41.4,41.4 | v18.9,43.4 v23.3,43.4 | JP6.P$3 5.08,46.42 8.5,43 8.5,42.3 v8.89,41.91
SCK  (via drill 0.6)
  Top 0.254: U1.17 24.92,28.93 23.88,28.93 23.7,28.75 22.9,28.75 22.25,29.4 21.91,29.74 v19.68,29.74 | v10.35,28.35 13.65,28.35 v14,28
  Bottom 0.254: ISP1.3 5.26,21.39 5.26,21.34 6.2,20.4 9.11,20.4 9.4,20.69 9.4,28.1 9.65,28.35 v10.35,28.35 | v14,28 19,28 19.5,28.5 19.5,29.56 v19.68,29.74
SCL  (via drill 0.7)
  Top 0.254: U1.28 21.1,47.7 22.8,49.4 22.8,54 26.2,57.4 32.4,57.4 v51.8,76.8
  Bottom 0.254: v51.8,76.8 55.13,76.8 CN1.4
SDA
  Top 0.254: U1.27 21.9,44.4 30,52.5 35.5,52.5 39,56 39,56.5 43,60.5 43,61 52,70 52,74.8 54.5,77.3 CN1.3
TARE  (via drill 0.6, 0.7)
  Top 0.254: v69.7,34.6 69.7,31.3 67.3,28.9 67.3,14.5 66.7,13.9 59.4,13.9 58.5,13 56,13 55.5,13.5 55.5,15 v56.5,16 | v36.5,18.3 v43.8,18.3 | U1.11 19.5,22 20,21.5 | 20,21.5 26.5,15 28.85,12.65 v30.35,12.65 | R8.1 14.43,22.57 15.5,21.5 20,21.5 | 20,21.5
  Top 0.406: v69.7,64.9 69.7,91.3 67.5,93.5 67.5,95 68.5,96 70.31,96 S2.1 S2.2
  Bottom 0.254: v69.7,64.9 v69.7,34.6 | v43.8,18.3 45.2,18.3 46.3,17.2 52.9,17.2 53.1,17 56,17 56.5,16.5 v56.5,16 | v36.5,18.3 36.3,18.3 35,17 35,13.55 34.2,12.75 30.45,12.75 v30.35,12.65
TXD  (via drill 0.6)
  Top 0.254: 18.75,36.25 U1.31 18.7,39 | 18.7,39 16.7,41 v12,41 | 18.7,39 18.7,40.8 v18.4,41.1 | v23.2,41.8 27.2,41.8 27.9,41.1 39.1,41.1 v42.7,37.5 | JP2.2 48.4,44.32 48.4,40.7 46.5,38.8 v46.3,38.8
  Bottom 0.254: JP6.P$2 5.26,49.51 6.4,48.36 6.4,46.6 v12,41 | v18.4,41.1 18.4,41.4 18.8,41.8 v23.2,41.8 | v46.3,38.8 45,37.5 v42.7,37.5
V_ADJ
  Top 0.406: IC1.1 24.8,71.2 26,70 D2.A
  Bottom 0.203: R17.1 34.06,81.46 R18.2 R16.2
  Bottom 0.254: R15.1 34.06,75.66 R16.2 34.11,72.34 R14.1 34.1,72.25 32.5,72.25 | R13.1 32.5,72.25 | 32.5,72.25 32.5,71.5 32.2,71.2 28.3,71.2 27.5,72 22.8,72 22.3,71.5 IC1.1 21,72.2 C9.1
WB_ARM1  (via drill 0.6)
  Top 0.254: U$4.3 U$4.4 92.65,24.42 92.65,20.4 93.15,19.9 v94.85,19.9 | R29.2 94.96,15.74 v94,16.7
  Bottom 0.254: v94.85,19.9 95.8,19.9 96.1,19.6 96.1,17.15 95.65,16.7 v94,16.7
WB_ARM2  (via drill 0.6)
  Top 0.254: U$5.P$2 69.85,26.85 69,26 69,20.89 R28.2 69.13,19.37 69.5,19 70.5,19 73.5,16 v78.5,16
  Bottom 0.254: v78.5,16 80.5,14 84,14 86,12 88.5,12 89,12.5 89,15.3 v90.4,16.7

### Text on the board
tPlace: Reset | Tare | Config | Remote Kill Override | ESTOP1 | ESTOP2 | Remote Kill | 7-segment Display | WARNING: Solder only / one H2 sensor and its / components on each / PCB. / Refer documentation. | IDT SGAS 701 | Note: This board has multiple / configuration options and / specific rules for / operation. / Please read the documentation / carefully before soldering / and operating this board. | MQ-8 | Sparkfun Openlog | Figaro TGS6812 | Protoboard | Hydrogen Board V3 | uAlberta EcoCar Team | Wheatstone Bridge Arms / Multimeter Probe Points | Arm2 | Arm1 | 3 | From / on-board / regulator / (+Ub) | 5V Vcc source / selector | 2 | 1 | From / FCC
bPlace: WARNING: Solder only one / branch of resistors / on each PCB. / Refer / documentation. | Figaro | Figaro | C:/EAGLE-7.6.0/ulp/bw_bmp_chem_cat.bmp | IDT | MQ-8 | Ordered: YYYY/MM/DD